# EAGLE design AnyTelemetry (EAGLE 6.5.0)
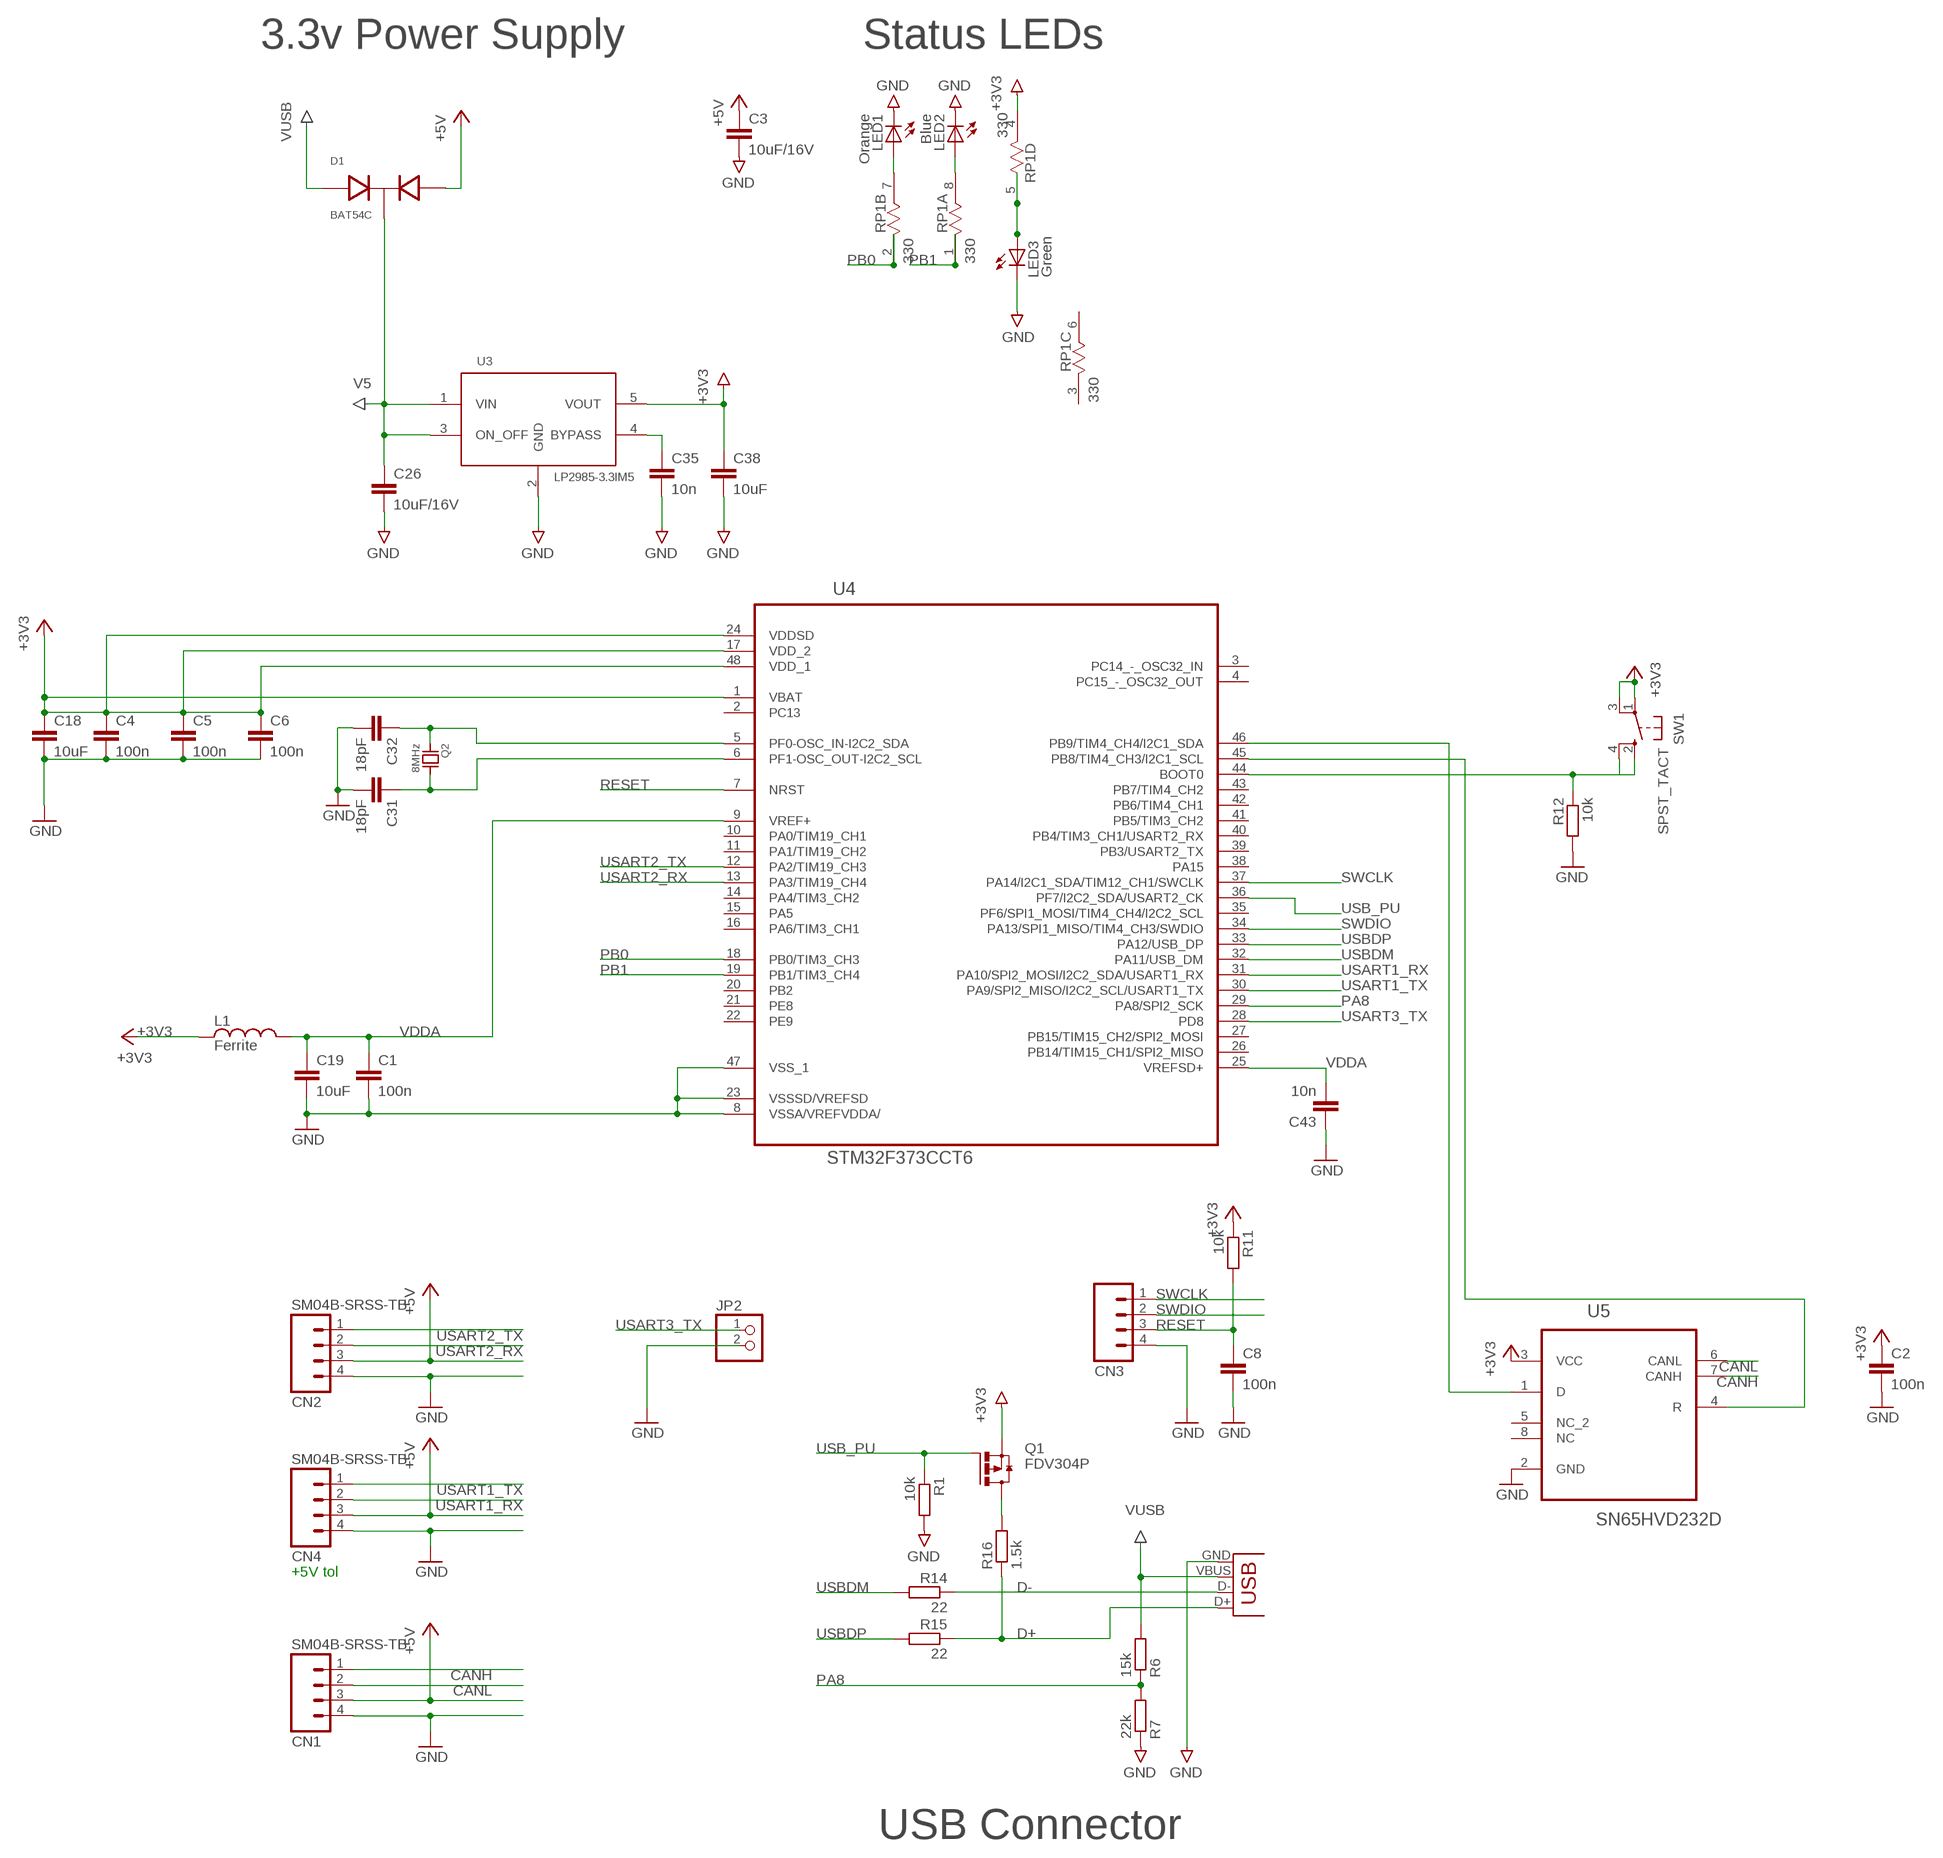
[diagram p0: schematic, sheet 1]

## Parts
C1  100n  CAPACITOR0603  [0603]
C2  100n  CAPACITOR0603  [0603]
C3  10uF/16V  C-EUC0805  [C0805]
C4  100n  CAPACITOR0603  [0603]
C5  100n  CAPACITOR0603  [0603]
C6  100n  CAPACITOR0603  [0603]
C8  100n  CAPACITOR0603  [0603]
C18  10uF  C-EUC0805  [C0805]
C19  10uF  C-EUC0805  [C0805]
C26  10uF/16V  C-EUC0805  [C0805]
C31  18pF  CAPACITOR0603  [0603]
C32  18pF  CAPACITOR0603  [0603]
C35  10n  C-EUC0603  [C0603]
C38  10uF  C-EUC0805  [C0805]
C43  10n  CAP0603-CAP  [0603-CAP]
CN1  SM04B-SRSS-TB  [SM04B-SRSS-TB]
CN2  SM04B-SRSS-TB  [SM04B-SRSS-TB]
CN3  SM04B-SRSS-TB  [SM04B-SRSS-TB]
CN4  SM04B-SRSS-TB  [SM04B-SRSS-TB]
D1  BAT54C  [SOT23]
JP2  PINHD-1X02_2.54-S  [1X02-S]
L1  Ferrite  INDUCTOR0603  [0603]
LED1  Orange  LEDCHIPLED_0603  [CHIPLED_0603]
LED2  Blue  LEDCHIPLED_0603  [CHIPLED_0603]
LED3  Green  LEDCHIPLED_0603  [CHIPLED_0603]
Q1  FDV304P  FDN360P  [SUPER-SOT3]
Q2  8MHz  CRYSTAL-5X3  [CRYSTAL-5X3]
R1  10k  R-EU_R0603  [R0603]
R6  15k  R-EU_R0603  [R0603]
R7  22k  R-EU_R0603  [R0603]
R11  10k  R-EU_R0603  [R0603]
R12  10k  R-EU_R0603  [R0603]
R14  22  R-EU_R0603  [R0603]
R15  22  R-EU_R0603  [R0603]
R16  1.5k  R-EU_R0603  [R0603]
RP1  330  RES4NT  [RES4NT]
SW1  SPST_TACT  [EVQ-PU]
U3  LP2985-3.3IM5  [SOT23-5]
U4  STM32F373CCT6  [QFP50P900X900X160-48N]
U5  SN65HVD232D  [SOIC127P600X175-8N]
X2  USBSMD  [USB-MINIB]

## Nets
+3V3: C2.1 C4.1 C5.1 C6.1 C18.1 C38.1 L1.1 Q1.2(S) R11.1 RP1.4 SW1.1(P) SW1.3(P1) U3.5(VOUT) U4.1(VBAT) U4.17(VDD_2) U4.24(VDDSD) U4.48(VDD_1) U5.3(VCC)
+5V: C3.1 CN1.3 CN2.3 CN4.3 D1.2
BOOT0: R12.1 SW1.2(S) SW1.4(S1) U4.44(BOOT0)
CANH: CN1.1 U5.7(CANH)
CANL: CN1.2 U5.6(CANL)
D+: R15.1 R16.1 X2.D+
D-: R14.1 X2.D-
GND: C1.2 C2.2 C3.2 C4.2 C5.2 C6.2 C8.2 C18.2 C19.2 C26.2 C31.2 C32.2 C35.2 C38.2 C43.1 CN1.4 CN2.4 CN3.4 CN4.4 JP2.2 LED1.C LED2.C LED3.C R1.2 R7.1 R12.2 U3.2(GND) U4.8(VSSA/VREFVDDA/) U4.23(VSSSD/VREFSD) U4.47(VSS_1) U5.2(GND) X2.GND
N$1: Q1.3(D) R16.2
N$7: LED1.A RP1.7
N$8: LED2.A RP1.8
N$11: LED3.A RP1.5
N$28: C31.1 Q2.3 U4.6(PF1-OSC_OUT-I2C2_SCL)
N$29: C32.1 Q2.1 U4.5(PF0-OSC_IN-I2C2_SDA)
N$38: C35.1 U3.4(BYPASS)
PA8: R6.1 R7.2 U4.29(PA8/SPI2_SCK)
PB0: RP1.2 U4.18(PB0/TIM3_CH3)
PB1: RP1.1 U4.19(PB1/TIM3_CH4)
RESET: C8.1 CN3.3 R11.2 U4.7(NRST)
RXCAN: U4.45(PB8/TIM4_CH3/I2C1_SCL) U5.4(R)
SWCLK: CN3.1 U4.37(PA14/I2C1_SDA/TIM12_CH1/SWCLK)
SWDIO: CN3.2 U4.34(PA13/SPI1_MISO/TIM4_CH3/SWDIO)
TXCAN: U4.46(PB9/TIM4_CH4/I2C1_SDA) U5.1(D)
USART1_RX: CN4.2 U4.31(PA10/SPI2_MOSI/I2C2_SDA/USART1_RX)
USART1_TX: CN4.1 U4.30(PA9/SPI2_MISO/I2C2_SCL/USART1_TX)
USART2_RX: CN2.2 U4.13(PA3/TIM19_CH4)
USART2_TX: CN2.1 U4.12(PA2/TIM19_CH3)
USART3_TX: JP2.1 U4.28(PD8)
USB_PU: Q1.1(G) R1.1 U4.36(PF7/I2C2_SDA/USART2_CK)
USBDM: R14.2 U4.32(PA11/USB_DM)
USBDP: R15.2 U4.33(PA12/USB_DP)
V5: C26.1 D1.3 U3.1(VIN) U3.3(ON_OFF)
VDDA: C1.1 C19.1 C43.2 L1.2 U4.9(VREF+) U4.25(VREFSD+)
VUSB: D1.1 R6.2 X2.VBUS
Unconnected: RP1.3 RP1.6 U4.2(PC13) U4.3(PC14_-_OSC32_IN) U4.4(PC15_-_OSC32_OUT) U4.10(PA0/TIM19_CH1) U4.11(PA1/TIM19_CH2) U4.14(PA4/TIM3_CH2) U4.15(PA5) U4.16(PA6/TIM3_CH1) U4.20(PB2) U4.21(PE8) U4.22(PE9) U4.26(PB14/TIM15_CH1/SPI2_MISO) U4.27(PB15/TIM15_CH2/SPI2_MOSI) U4.35(PF6/SPI1_MOSI/TIM4_CH4/I2C2_SCL) U4.38(PA15) U4.39(PB3/USART2_TX) U4.40(PB4/TIM3_CH1/USART2_RX) U4.41(PB5/TIM3_CH2) U4.42(PB6/TIM4_CH1) U4.43(PB7/TIM4_CH2) U5.5(NC_2) U5.8(NC)

## Notes on the sheet
- 3.3v Power Supply | Status LEDs
- +5V tol
- USB Connector

## Library data of the parts
C1 C2 C4-C6 C8 C31 C32 = OpenPilot:CAPACITOR: Capacitor Standard SMD ceramic capacitors.
C3 C18 C19 C26 C35 C38 = rcl:C-EU: CAPACITOR, European symbol
C43 = sparkfun:CAP: Capacitor Standard 0603 ceramic capacitor, and 0.1" leaded capacitor.
CN1-CN4 = OpenPilot:SM04B-SRSS-TB: JST SR Connector 4 pins, SMT (Side entry)
D1 = zik:BAT54C: Dual schottky diode
JP2 = pinhead-2:PINHD-1X02: PIN HEADER
L1 = OpenPilot:INDUCTOR
LED1-LED3 = led:LED: LED OSRAM: - CHIPLED LG R971, LG N971, LY N971, LG Q971, LY Q971, LO R971, LY R971 LH N974, LH R974 LS Q976, LO Q976, LY Q976 LO Q996 - Hyper CHIPLED LW Q18S LB Q993, LB Q99A, LB R99A - SideLED LS A670, LO A670, LY A670, LG A670, LP A670 LB A673, LV A673, LT A673, LW A673 LH A674 LY A675 LS A676, LA A676, LO A676, LY A676, LW A676 LS A679, LY A679, LG A679 - Hyper Micro SIDELED® LS Y876, LA Y876, LO Y876, LY Y876 LT Y87S - SmartLED LW L88C, LW L88S LB L89C, LB L89S, LG L890 LS L89K, LO L89K, LY L89K LS L896, LA L896, LO L896, LY L896 - TOPLED LS T670, LO T670, LY T670, LG T670, LP T670 LSG T670, LSP T670, LSY T670, LOP T670, LYG T670 LG T671, LOG T671, LSG T671 LB T673, LV T673, LT T673, LW T673 LH T674 LS T676, LA T676, LO T676, LY T676, LB T676, LH T676, LSB T676, LW T676 LB T67C, LV T67C, LT T67C, LS T67K, LO T67K, LY T67K, LW E67C LS E67B, LA E67B, LO E67B, LY E67B, LB E67C, LV E67C, LT E67C LW T67C LS T679, LY T679, LG T679 LS T770, LO T770, LY T770, LG T770, LP T770 LB T773, LV T773, LT T773, LW T773 LH T774 LS E675, LA E675, LY E675, LS T675 LS T776, LA T776, LO T776, LY T776, LB T776 LHGB T686 LT T68C, LB T68C - Hyper Mini TOPLED® LB M676 - Mini TOPLED Santana® LG M470 LS M47K, LO M47K, LY M47K Source: http://www.osram.convergy.de LUXEON: - LUMILED® LXK2-PW12-R00, LXK2-PW12-S00, LXK2-PW14-U00, LXK2-PW14-V00 LXK2-PM12-R00, LXK2-PM12-S00, LXK2-PM14-U00 LXK2-PE12-Q00, LXK2-PE12-R00, LXK2-PE12-S00, LXK2-PE14-T00, LXK2-PE14-U00 LXK2-PB12-K00, LXK2-PB12-L00, LXK2-PB12-M00, LXK2-PB14-N00, LXK2-PB14-P00, LXK2-PB14-Q00 LXK2-PR12-L00, LXK2-PR12-M00, LXK2-PR14-Q00, LXK2-PR14-R00 LXK2-PD12-Q00, LXK2-PD12-R00, LXK2-PD12-S00 LXK2-PH12-R00, LXK2-PH12-S00 LXK2-PL12-P00, LXK2-PL12-Q00, LXK2-PL12-R00 Source: www.luxeon.com KINGBRIGHT: KA-3528ASYC Source: www.kingbright.com
Q1 = transistor-power:FDN360P: Single P-Channel, PowerTrench (R) MOSFET Source: http://www.fairchildsemi.com/ds/FD/FDN360P.pdf
Q2 = OpenPilot:CRYSTAL: 5x3 Part: Digikey part: CTX639CT-ND or 535-9720-1-ND
R1 R6 R7 R11 R12 R14-R16 = rcl:R-EU_: RESISTOR, European symbol
RP1 = MySMD:RES4NT
SW1 = omat:SPST_TACT: SMT 6mm switch, EVQQ2 series http://www.ladyada.net/library/eagle
U3 = zik:LP2985-*: National Semiconductor LP2985 LDO regulator
U4 = STM32F373CCT6:STM32F373CCT6: MCU, 32BIT, CORTEX M4, 48LQFP; MPN: STM32F373CCT6; OC_FARNELL: 2215117; OC_NEWARK: 46W2195; PACKAGE: 48LQFP; SUPPLIER: STMicroelectronics
U5 = SN65HVD232D:SN65HVD232D: 3.3-V CAN TRANSCEIVERS; MPN: SN65HVD232D; OC_FARNELL: 1103107; OC_NEWARK: 35K4890; PACKAGE: SOIC-8; SUPPLIER: Texas Instruments
X2 = sparkfun:USB: USB Connectors USB-B-PTH is fully proven SKU : PRT-00139 USB-miniB is fully proven SKU : PRT-00587 USB-A-PCB is untested. USB-A-H is throughly reviewed, but untested. Spark Fun Electronics SKU : PRT-00437 USB-B-SMT is throughly reviewed, but untested. Needs silkscreen touching up. USB-A-S has not been used/tested USB-MB-H has not been used/tested

## Board
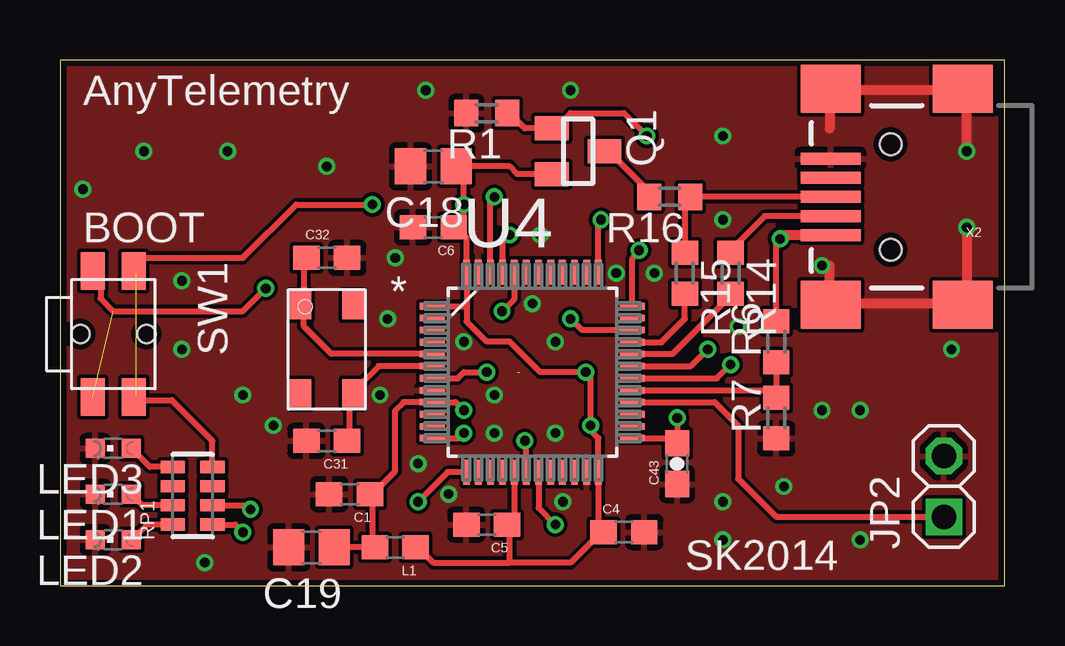
[diagram p1: board, top side]
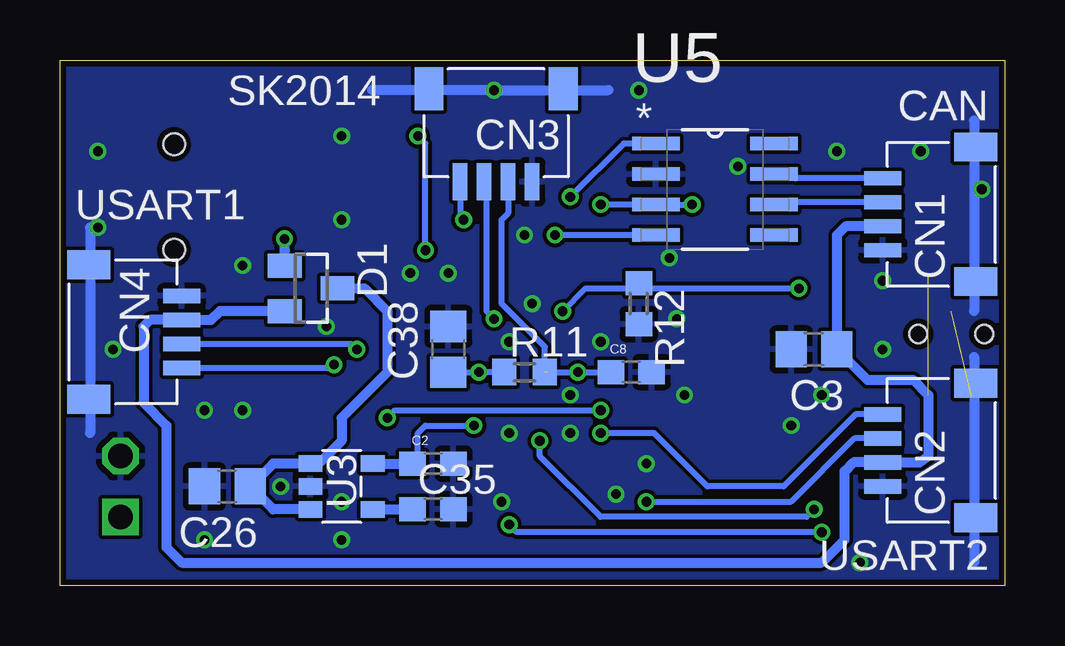
[diagram p2: board, bottom side, seen from below]

Size 39.36 x 21.9 mm. Coordinates in mm from the lower left corner, seen from the top.
Outline: 0,0 39.36,0 39.36,21.9 0,21.9 0,0
Copper layers (1*16): Top 0.035mm / dielectric 0.2mm / Bottom 0.035mm
Design rules "SeeedStudio_DRU_no_angle_20130527 *": minimum track width 6mil, minimum drill 12mil, track to track 6mil, track to pad 6mil, pad to pad 6mil, via to via 6mil, smd to smd 0mil, copper to edge 10mil, drill to drill 10mil, minimum pad ring 6mil, minimum via ring 6mil, stop-mask expansion 2mil, vias tented up to drill 25mil, thermal gap 10mil

### Footprints (pad centres in the part's own frame; a part is rotated, then mirrored left to right if it is on the bottom)
0603 = smd 1.1 x 1: 1 -0.85,0; 2 0.85,0
C0805 = smd 1.3 x 1.5: 1 -0.95,0; 2 0.95,0
C0603 = smd 1.1 x 1: 1 -0.85,0; 2 0.85,0
0603-CAP = smd 1.1 x 1: 1 -0.85,0; 2 0.85,0
SM04B-SRSS-TB = smd 0.6 x 1.55: 1 3,0; 2 2,0; 3 1,0; 4 0,0 | smd 1.2 x 1.8: NC@1 -1.3,-3.875; NC@2 4.3,-3.875
SOT23 = smd 1 x 1.4: 1 -0.95,-1.1; 2 0.95,-1.1; 3 0,1.1
1X02-S = drill 1.016 square: 1 -1.27,0 | drill 1.016 octagon: 2 1.27,0
CHIPLED_0603 = smd 0.8 x 0.8: A 0,-0.75; C 0,0.75
SUPER-SOT3 = smd 1 x 1.4: 1 -0.95,-1.1; 2 0.95,-1.1; 3 0,1.1
CRYSTAL-5X3 = smd 1.2 x 0.9: 1 1.85,1.1; 2 -1.85,1.1; 3 -1.85,-1.1; 4 1.85,-1.1
R0603 = smd 1 x 1.1: 1 -0.85,0; 2 0.85,0
RES4NT = smd 0.508 x 1.016: 1 0,0; 2 0.8,0; 3 1.6,0; 4 2.4,0; 5 2.4,1.651; 6 1.6,1.651; 7 0.8,1.651; 8 0,1.651
EVQ-PU = smd 1.55 x 1: 1 2.625,0.85; 2 2.625,-0.85; 3 -2.625,0.85; 4 -2.625,-0.85 | hole 0.75: 0,-1.375; 0,1.375
SOT23-5 = smd 0.69 x 0.99: 1 -0.95,-1.3; 2 0,-1.3; 3 0.95,-1.3; 4 0.95,1.3; 5 -0.95,1.3
QFP50P900X900X160-48N = smd 1.041 x 0.279: 1 -4.166,2.743; 2 -4.166,2.261; 3 -4.166,1.753; 4 -4.166,1.245; 5 -4.166,0.762; 6 -4.166,0.254; 7 -4.166,-0.254; 8 -4.166,-0.762; 9 -4.166,-1.245; 10 -4.166,-1.753; 11 -4.166,-2.261; 12 -4.166,-2.743; 25 4.166,-2.743; 26 4.166,-2.261; 27 4.166,-1.753; 28 4.166,-1.245; 29 4.166,-0.762; 30 4.166,-0.254; 31 4.166,0.254; 32 4.166,0.762; 33 4.166,1.245; 34 4.166,1.753; 35 4.166,2.261; 36 4.166,2.743 | smd 0.279 x 1.041: 13 -2.743,-4.166; 14 -2.261,-4.166; 15 -1.753,-4.166; 16 -1.245,-4.166; 17 -0.762,-4.166; 18 -0.254,-4.166; 19 0.254,-4.166; 20 0.762,-4.166; 21 1.245,-4.166; 22 1.753,-4.166; 23 2.261,-4.166; 24 2.743,-4.166; 37 2.743,4.166; 38 2.261,4.166; 39 1.753,4.166; 40 1.245,4.166; 41 0.762,4.166; 42 0.254,4.166; 43 -0.254,4.166; 44 -0.762,4.166; 45 -1.245,4.166; 46 -1.753,4.166; 47 -2.261,4.166; 48 -2.743,4.166
SOIC127P600X175-8N = smd 1.981 x 0.559: 1 -2.464,1.905; 2 -2.464,0.635; 3 -2.464,-0.635; 4 -2.464,-1.905; 5 2.464,-1.905; 6 2.464,-0.635; 7 2.464,0.635; 8 2.464,1.905
USB-MINIB = smd 2.5 x 0.5: D+ 2.5,0; D- 2.5,0.8; GND 2.5,-1.6; ID 2.5,-0.8; VBUS 2.5,1.6 | smd 2.5 x 2: GND@1 -3,-4.5; GND@2 -3,4.5; GND@3 2.5,4.5; GND@4 2.5,-4.5 | hole 0.9: 0,2.2; 0,-2.2

### Placement (x,y rotation side)
C1  12.06,3.81 180 top
C2  23.81,5.08 0 bottom
C3  7.94,9.84 180 bottom
C4  23.5,2.22 0 top
C5  17.78,2.54 180 top
C6  15.56,14.92 180 top
C8  15.56,8.89 0 bottom
C18  15.56,17.46 180 top
C19  10.48,1.59 180 top
C26  32.38,4.13 180 bottom
C31  11.11,6.03 180 top
C32  11.11,13.65 0 top
C35  23.81,3.17 0 bottom
C38  23.18,9.84 90 bottom
C43  25.72,5.08 90 top
CN1  5.08,13.97 90 bottom
CN2  5.08,4.13 90 bottom
CN3  19.68,16.83 180 bottom
CN4  34.29,12.06 270 bottom
D1  28.89,12.38 270 bottom
JP2  36.83,4.13 90 top
L1  13.97,1.59 180 top
LED1  2.22,3.81 90 top
LED2  2.22,1.91 90 top
LED3  2.22,5.71 90 top
Q1  21.59,18.1 270 top
Q2  11.11,9.84 90 top
R1  17.78,19.68 180 top
R6  29.84,10.16 90 top
R7  29.84,6.99 90 top
R11  20,8.89 0 bottom
R12  15.24,11.75 270 bottom
R14  27.94,13.02 270 top
R15  26.04,13.02 270 top
R16  25.4,16.19 180 top
RP1  6.35,2.54 90 top
SW1  2.22,10.48 270 top
U3  27.62,4.13 270 bottom
U4  19.68,8.89 0 top
U5  12.06,16.51 0 bottom
X2  34.61,16.19 180 top

### Tracks (layer width: path | path; a pad name or v marks a point on that pad's centre or on a via)
+3V3  (via drill 0.4)  (1 unrouted)
  Top 0.254: U4.17 18.92,2.88 C5.1 18.73,2.44 18.73,0.95 | 16.94,11.75 U4.48 16.94,14.49 16.83,14.61 16.51,14.82 | 16.94,11.75 16.94,11 17.78,10.16 18.73,10.16 20,8.89 v21.91,8.89 22.11,8.69 v22.11,6.67 22.23,6.35 22.43,6.15 U4.24 22.43,2.02 22.54,2.22 | U4.1 16.83,11.63 16.94,11.75 | 22.54,2.22 22.54,2.33 C4.1 | 16.51,14.82 C6.1 16.51,14.92 | 16.51,14.82 16.51,14.92 | 16.51,14.92 16.83,15.24 v16.83,15.88 16.83,17.46 | L1.1 15.24,1.27 15.56,0.95 18.73,0.95 | 22.54,2.22 21.27,0.95 18.73,0.95 | 16.83,17.46 18.73,17.46 19.05,17.14 Q1.2 | SW1.3 2.94,13.1 3.49,13.65 7.62,13.65 9.84,15.88 v13.02,15.88 | C18.1 16.83,17.46 | 3.39,7.72 4.66,7.72 6.35,6.03 RP1.4
  Top 0.406: SW1.1 3.39,7.72 3.17,7.94 | 3.17,13.02 3.17,13 SW1.3
  Bottom 0.254: v13.02,15.88 U5.3 v16.83,15.88 | U3.5 24.55,5.08 C2.1 24.45,5.08 24.45,6.35 24.13,6.67 v22.11,6.67 | 20.95,8.89 R11.1 v21.91,8.89 C38.1
  Bottom 0.406: U3.5 25.08,5.08
+5V
  Bottom 0.254: C3.1
  Bottom 0.406: CN1.3 6.62,14.97 6.99,14.61 C3.1 5.71,8.57 3.81,8.57 3.17,7.94 3.17,5.4 3.54,5.13 CN2.3 6.3,5.13 6.67,4.76 6.67,1.91 7.62,0.95 34.29,0.95 34.92,1.59 34.92,6.67 35.88,7.62 35.88,10.79 35.61,11.06 CN4.3 33.07,11.06 32.7,11.43 D1.2
BOOT0  (via drill 0.4)  (1 unrouted)
  Top 0.254: U4.44 18.92,11.94 v18.41,11.43 | v8.57,12.38 7.62,11.43 2.22,11.43 1.69,11.96 1.69,12.91 arc90 1.59,13.02
  Top 0.406: SW1.4 1.37,13.23 1.59,13.02 | 1.27,7.75 SW1.2
  Bottom 0.254: v18.41,11.43 17.46,12.38 15.24,12.38 | 15.24,12.38 v8.57,12.38 | R12.1 15.24,12.38
CANH
  Bottom 0.254: CN1.1 8.71,16.97 8.89,17.14 U5.7
CANL
  Bottom 0.254: CN1.2 8.79,15.97 8.89,15.88 U5.6
D+
  Top 0.254: X2.D+ 26.35,16.19 26.04,15.88 | 26.04,15.88 26.04,13.65 26.05,13.98 R15.1 | R16.1 26.04,15.88
D-
  Top 0.254: X2.D- 29.36,15.39 28.26,14.29 R14.1
GND  (via drill 0.4)
  Top 0.406: v37.78,18.1 37.78,20.64 32.07,20.64 32.07,19.05 | v37.78,14.92 37.78,11.75 32.07,11.75 32.07,13.34
  Bottom 0.406: 1.27,9.53 1.27,0.95 | 1.27,19.37 1.27,11.43 | 26.35,20.64 v21.27,20.64 16.51,20.64 | v37.78,14.92 38.1,14.92 38.1,6.35
  other vias: 20.95,3.49 16.83,10.16 20.64,6.35 19.68,11.75 13.97,13.65 23.18,13.02 16.19,3.81 14.92,5.08 0.95,16.51 8.89,6.67 13.65,11.11 5.08,12.7 18.1,6.35 33.34,1.91 27.62,1.91 20.64,10.16 3.49,18.1 37.15,9.84 11.11,17.46 27.62,18.73 15.24,20.64 6.99,18.1 7.62,7.94 18.1,7.94 5.08,9.84 13.34,7.94 20,14.61 31.75,7.3 31.75,13.34 27.62,15.24 24.77,13.02 28.26,10.79 30.16,4.13 27.62,3.49 6.03,0.95 33.34,7.3
  pour Bottom: -12.7,-3.81 51.44,-3.81 51.44,28.57 -12.7,28.57
  pour Top: -9.53,0 48.26,0 48.26,25.4 -9.53,25.4
N$1
  Top 0.254: 24.45,15.88 R16.2 24.77,16.19 23.18,17.78 23.18,18.1 22.86,17.78 22.54,18.1 22.69,18.27 Q1.3
N$7
  Top 0.254: RP1.7 3.44,3.34 LED1.A
N$8
  Top 0.254: RP1.8 3.61,2.54 LED2.A
N$11
  Top 0.254: RP1.5 3.75,4.94 LED3.A
N$28
  Top 0.254: C31.1 11.96,6.25 12.06,6.35 12.06,8.14 Q2.3 12.16,8.26 12.38,8.26 | U4.6 13.27,9.14 12.38,8.26 | 12.06,7.94 12.38,8.26
N$29
  Top 0.254: C32.1 10.16,13.65 10.16,11.75 | 10.16,11.75 10.16,11.23 | 10.16,11.23 Q2.1 10.01,11.89 10.16,11.75 | U4.5 11.3,9.65 10.16,10.79 10.16,11.23
N$38
  Bottom 0.406: 24.86,3.17 C35.1 24.73,2.99 24.77,3.17 24.77,3.18 U3.4
PA8
  Top 0.254: U4.29 29.65,8.13 29.84,7.94 | R6.1 29.84,7.94 | 29.84,7.94 R7.2
PB0  (via drill 0.4)
  Top 0.254: U4.18 19.43,5.97 v19.37,6.03 | RP1.2 7.79,3.34 v7.94,3.17
  Bottom 0.254: v7.94,3.17 8.26,2.86 16.83,2.86 19.37,5.4 v19.37,6.03
PB1  (via drill 0.4)
  Top 0.254: U4.19 19.94,3.24 v20.64,2.54 | RP1.1 7.3,2.54 v7.62,2.22
  Bottom 0.254: v7.62,2.22 20.32,2.22 v20.64,2.54
RESET  (via drill 0.4)  (1 unrouted)
  Top 0.254: U4.7 16.57,8.64 16.83,8.89 v17.78,8.89
  Bottom 0.254: 19.05,8.89 v17.78,8.89 C8.1 | R11.2 19.15,9.95 20.95,11.75 20.95,15.24 20.68,15.51 CN3.3
RXCAN  (via drill 0.4)
  Top 0.254: U4.45 18.44,14.31 v18.73,14.61
  Bottom 0.254: U5.4 v18.73,14.61
SWCLK  (via drill 0.4)
  Top 0.254: U4.37 22.43,15.04 v22.54,15.24
  Bottom 0.254: CN3.1 22.68,15.41 v22.54,15.24
SWDIO  (via drill 0.4)
  Top 0.254: U4.34 21.75,10.64 v21.27,11.11
  Bottom 0.254: CN3.2 21.68,16.29 21.59,16.19 21.59,11.43 v21.27,11.11 21.37,11.02
TXCAN  (via drill 0.4)
  Top 0.254: U4.46 17.93,16.03 v18.1,16.19
  Bottom 0.254: U5.1 15.88,18.41 v18.1,16.19
USART1_RX  (via drill 0.4)
  Top 0.254: U4.31 26.29,9.14 v26.99,9.84
  Bottom 0.254: CN4.2 27.21,10.06 v26.99,9.84
USART1_TX  (via drill 0.4)
  Top 0.254: U4.30 27.37,8.64 v27.94,9.21
  Bottom 0.254: CN4.1 28.11,9.06 v27.94,9.21
USART2_RX  (via drill 0.4)
  Top 0.254: U4.13 16.15,4.72 v14.92,3.49
  Bottom 0.254: CN2.2 6.25,6.13 8.89,3.49 v14.92,3.49
USART2_TX  (via drill 0.4)
  Top 0.254: U4.12 16.62,6.15 v16.83,6.35
  Bottom 0.254: v16.83,6.35 14.61,6.35 12.38,4.13 9.21,4.13 6.21,7.13 CN2.1
USART3_TX
  Top 0.254: U4.28 27.28,7.64 28.26,6.67 28.26,4.45 29.84,2.86 JP2.1
USB_PU  (via drill 0.4)
  Top 0.254: v24.45,18.73 23.5,19.68 21.27,19.68 20.64,19.05 20.64,18.83 Q1.1 19.37,19.05 18.63,19.79 R1.1 | U4.36 23.85,13.61 v24.13,13.97
  Bottom 0.254: v24.13,13.97 24.13,18.41 v24.45,18.73
USBDM
  Top 0.254: U4.32 25.53,9.65 27.94,12.06 R14.2
USBDP
  Top 0.254: U4.33 25.06,10.13 26.04,11.11 R15.2
V5
  Bottom 0.406: U3.3 30.48,3.17 C26.1 30.48,5.08 U3.1 28.58,5.08 27.62,6.03 27.62,6.99 25.72,8.89 25.72,11.43 26.67,12.38 D1.3
VDDA  (via drill 0.4)
  Top 0.254: 13.02,3.81 C1.1 13.02,3.81 | 13.02,3.81 | 13.02,3.81 13.02,1.59 | 13.02,1.59 C19.1 | 13.02,1.59 L1.2 | U4.25 25.82,6.15 C43.2 v25.72,6.99 | 13.02,3.81 13.97,4.76 13.97,7.3 14.31,7.64 U4.9 16.48,7.64 v16.83,7.3
  Bottom 0.254: v25.72,6.99 25.4,7.3 v16.83,7.3
VUSB  (via drill 0.4)
  Top 0.254: R6.2 29.84,14.29 v30,14.45
  Top 0.406: X2.VBUS 30.15,14.59 v30,14.45
  Bottom 0.406: D1.1 29.99,13.97 | 29.99,13.97 v29.99,14.45 | v30,14.45 30,13.98 29.99,13.97

### Text on the board
tPlace: AnyTelemetry | BOOT | SK2014
bPlace: SK2014 | CAN | USART1 | USART2